# Altium schematic sheet Connect_board.SchDoc
size A3
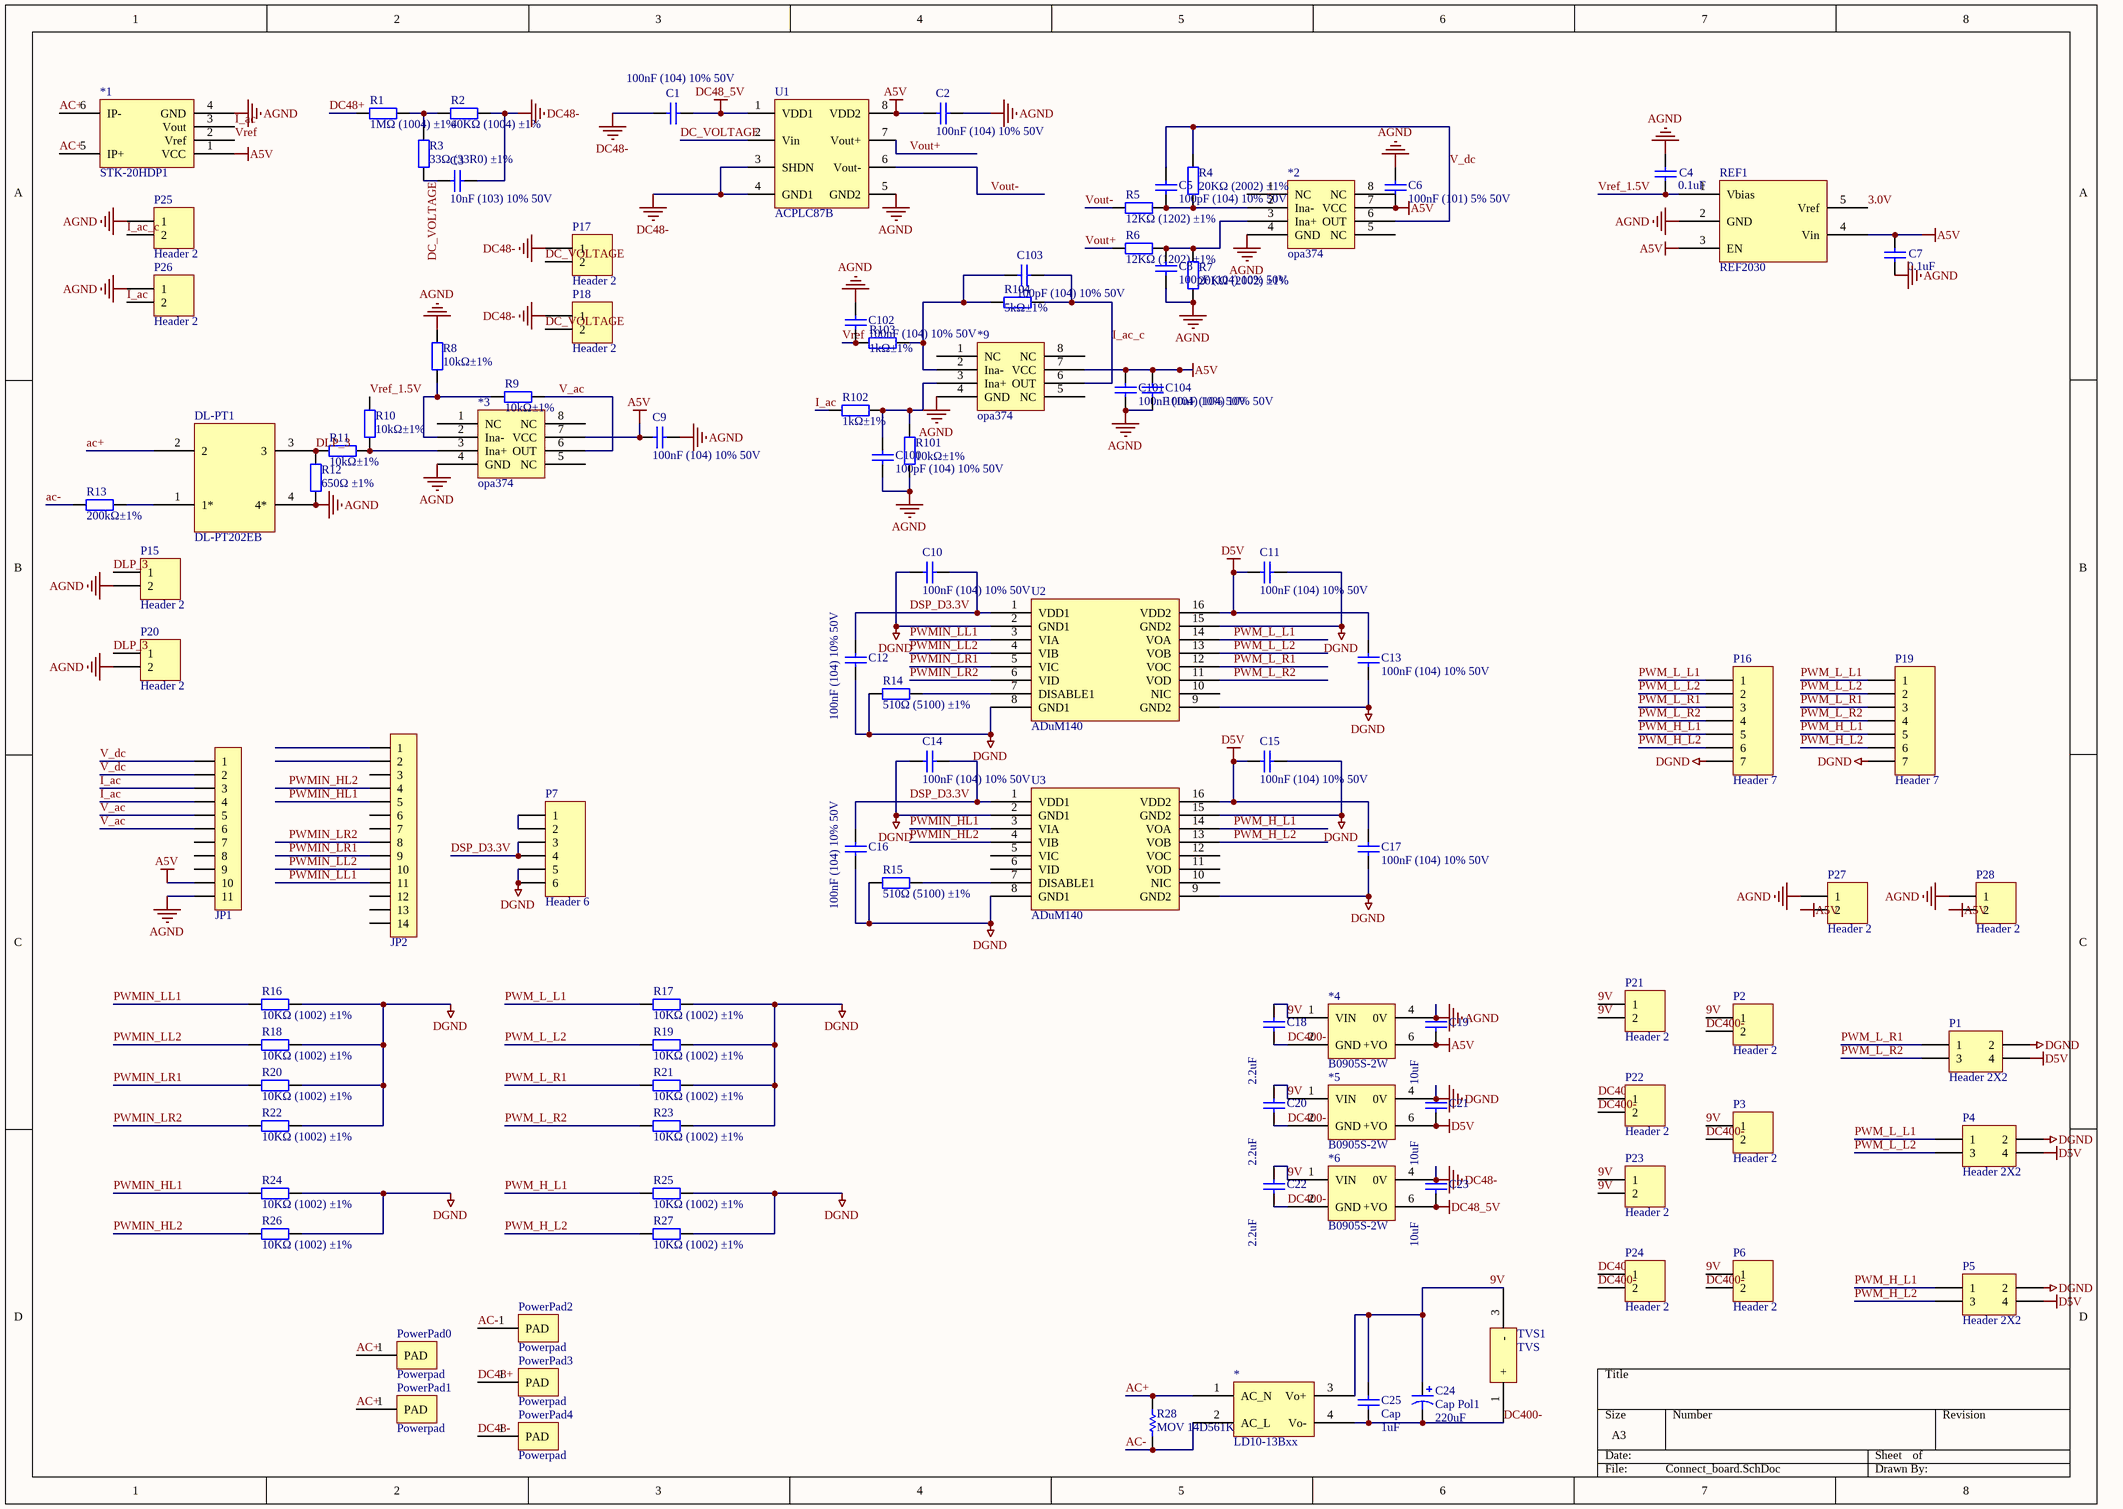
[diagram p0: Connect_board.SchDoc]

## Parts
*  LD10-13Bxx  [LD10-13]
*1  STK-20HDP1  [STK-20HDP1]
*2  opa374  [OPA2374]
*3  opa374  [OPA2374]
*4  B0905S-2W  [B0905S-2W]
*5  B0905S-2W  [B0905S-2W]
*6  B0905S-2W  [B0905S-2W]
*9  opa374  [OPA2374]
C1  100nF (104) 10% 50V  [0603_C]
C2  100nF (104) 10% 50V  [0603_C]
C3  10nF (103) 10% 50V  [1206R]
C4  value 0.1uF  [0603_C]  (hidden comment: Cap)
C5  100pF (104) 10% 50V  [0603_C]
C6  100nF (101) 5% 50V  [0603_C]
C7  value 0.1uF  [0603_C]  (hidden comment: Cap)
C8  100pF (104) 10% 50V  [0603_C]
C9  100nF (104) 10% 50V  [0603_C]
C10  100nF (104) 10% 50V  [0603_C]
C11  100nF (104) 10% 50V  [0603_C]
C12  100nF (104) 10% 50V  [0603_C]
C13  100nF (104) 10% 50V  [0603_C]
C14  100nF (104) 10% 50V  [0603_C]
C15  100nF (104) 10% 50V  [0603_C]
C16  100nF (104) 10% 50V  [0603_C]
C17  100nF (104) 10% 50V  [0603_C]
C18  2.2uF  [0603_C]
C19  10uF  [0603_C]
C20  2.2uF  [0603_C]
C21  10uF  [0603_C]
C22  2.2uF  [0603_C]
C23  10uF  [0603_C]
C24  Cap Pol1  value 220uF  [RB7.6-15]
C25  Cap  value 1uF  [0603_c]
C100  100pF (104) 10% 50V  [0603_C]
C101  100nF (104) 10% 50V  [0603_C]
C102  100nF (104) 10% 50V  [0603_C]
C103  100pF (104) 10% 50V  [0603_C]
C104  100nF (104) 10% 50V  [0603_C]
DL-PT1  DL-PT202EB  [DL-PT202EB]
JP1  HDR-1X11  [HDR1X11]  (value not drawn)
JP2  HDR-1X14  [HDR1X14]  (value not drawn)
P1  Header 2X2  [HDR2X2]
P2  Header 2  [HDR1X2]
P3  Header 2  [HDR1X2]
P4  Header 2X2  [HDR2X2]
P5  Header 2X2  [HDR2X2]
P6  Header 2  [HDR1X2]
P7  Header 6  [HDR1X6]
P15  Header 2  [HDR1X2]
P16  Header 7  [HDR1X7]
P17  Header 2  [HDR1X2]
P18  Header 2  [HDR1X2]
P19  Header 7  [HDR1X7]
P20  Header 2  [HDR1X2]
P21  Header 2  [HDR1X2]
P22  Header 2  [HDR1X2]
P23  Header 2  [HDR1X2]
P24  Header 2  [HDR1X2]
P25  Header 2  [HDR1X2]
P26  Header 2  [HDR1X2]
P27  Header 2  [HDR1X2]
P28  Header 2  [HDR1X2]
PowerPad0  Powerpad  [POWERPAD]
PowerPad1  Powerpad  [POWERPAD]
PowerPad2  Powerpad  [POWERPAD]
PowerPad3  Powerpad  [POWERPAD]
PowerPad4  Powerpad  [POWERPAD]
R1  1MΩ (1004) ±1%  [1206R]
R2  40KΩ (1004) ±1%  [1206R]
R3  33Ω (33R0) ±1%  [1206R]
R4  20KΩ (2002) ±1%  [0603_R]
R5  12KΩ (1202) ±1%  [0603_R]
R6  12KΩ (1202) ±1%  [0603_R]
R7  20KΩ (2002) ±1%  [0603_R]
R8  10kΩ±1%  [0603_R]
R9  10kΩ±1%  [0603_R]
R10  10kΩ±1%  [0603_R]
R11  10kΩ±1%  [0603_R]
R12  650Ω ±1%  [0603_R]
R13  200kΩ±1%  [1206R]
R14  510Ω (5100) ±1%  [0603_R]
R15  510Ω (5100) ±1%  [0603_R]
R16  10KΩ (1002) ±1%  [0603_R]
R17  10KΩ (1002) ±1%  [0603_R]
R18  10KΩ (1002) ±1%  [0603_R]
R19  10KΩ (1002) ±1%  [0603_R]
R20  10KΩ (1002) ±1%  [0603_R]
R21  10KΩ (1002) ±1%  [0603_R]
R22  10KΩ (1002) ±1%  [0603_R]
R23  10KΩ (1002) ±1%  [0603_R]
R24  10KΩ (1002) ±1%  [0603_R]
R25  10KΩ (1002) ±1%  [0603_R]
R26  10KΩ (1002) ±1%  [0603_R]
R27  10KΩ (1002) ±1%  [0603_R]
R28  MOV 14D561K  [AXIAL-0.3]
R101  10kΩ±1%  [0603_R]
R102  1kΩ±1%  [0603_R]
R103  1kΩ±1%  [0603_R]
R104  5kΩ±1%  [0603_R]
REF1  REF2030  [SOT23-5]
TVS1  TVS  [SMB]
U1  ACPLC87B  [LC-SOP-8_268mil]
U2  ADuM140  [LC-SOIC-16_208mil]
U3  ADuM140  [LC-SOIC-16_208mil]

## Nets
A5V: *1.1(VCC) *2.7(VCC) *3.7(VCC) *4.6(+VO) *9.7(VCC) C2.2 C6.1 C7.1 C9.1 C19.2 C101.1 C104.1 JP1.10 P27.2 P28.2 REF1.3(EN) REF1.4(Vin) U1.8(VDD2)
AGND: *1.4(GND) *2.4(GND) *3.4(GND) *4.4(0V) *9.4(GND) C2.1 C4.1 C6.2 C7.2 C8.2 C9.2 C19.1 C100.2 C101.2 C102.1 C104.2 DL-PT1.4(4*) JP1.11 P15.2 P20.2 P25.1 P26.1 P27.1 P28.1 R7.1 R8.2 R12.1 R101.2 REF1.2(GND) U1.5(GND2)
D5V: *5.6(+VO) C11.1 C13.2 C15.1 C17.2 C21.2 P1.4 P4.4 P5.4 U2.16(VDD2) U3.16(VDD2)
DC48-: *6.4(0V) C1.2 C3.1 C23.1 P17.1 P18.1 PowerPad4.1(PAD) R2.2 U1.3(SHDN) U1.4(GND1)
DC48_5V: *6.6(+VO) C1.1 C23.2 U1.1(VDD1)
DGND: *5.4(0V) C10.1 C11.2 C12.2 C13.1 C14.1 C15.2 C16.2 C17.1 C21.1 P1.2 P4.2 P5.2 P7.5 P7.6 P16.7 P19.7 R14.1 R15.1 R16.2 R17.2 R18.2 R19.2 R20.2 R21.2 R22.2 R23.2 R24.2 R25.2 R26.2 R27.2 U2.2(GND1) U2.8(GND1) U2.9(GND2) U2.15(GND2) U3.2(GND1) U3.8(GND1) U3.9(GND2) U3.15(GND2)
3.0V: REF1.5(Vref)
9V: *.3(Vo+) *4.1(VIN) *5.1(VIN) *6.1(VIN) C18.1 C20.1 C22.1 C24.1 C25.1 P2.1 P3.1 P6.1 P21.1 P21.2 P23.1 P23.2 TVS1.3(-)
AC+: *.1(AC_N) *1.5(IP+) *1.6(IP-) DL-PT1.2 PowerPad0.1(PAD) PowerPad1.1(PAD) R28.2
AC-: *.2(AC_L) PowerPad2.1(PAD) R13.1 R28.1
DC48+: PowerPad3.1(PAD) R1.1
DC400-: *.4(Vo-) *4.2(GND) *5.2(GND) *6.2(GND) C18.2 C20.2 C22.2 C24.2 C25.2 P2.2 P3.2 P6.2 P22.1 P22.2 P24.1 P24.2 TVS1.1(+)
DC_VOLTAGE: C3.2 P17.2 P18.2 R3.1 U1.2(Vin)
DLP_3: DL-PT1.3 P15.1 P20.1 R11.1 R12.2
DSP_D3.3V: C10.2 C12.1 C14.2 C16.1 P7.3 P7.4 U2.1(VDD1) U3.1(VDD1)
I_ac: *1.3(Vout) JP1.3 JP1.4 P26.2 R102.2
I_ac_c: *9.6(OUT) C103.2 P25.2 R104.1
PWM_H_L1: P5.1 P16.5 P19.5 R25.1 U3.14(VOA)
PWM_H_L2: P5.3 P16.6 P19.6 R27.1 U3.13(VOB)
PWM_L_L1: P4.1 P16.1 P19.1 R17.1 U2.14(VOA)
PWM_L_L2: P4.3 P16.2 P19.2 R19.1 U2.13(VOB)
PWM_L_R1: P1.1 P16.3 P19.3 R21.1 U2.12(VOC)
PWM_L_R2: P1.3 P16.4 P19.4 R23.1 U2.11(VOD)
PWMIN_HL1: JP2.5 R24.1 U3.3(VIA)
PWMIN_HL2: JP2.4 R26.1 U3.4(VIB)
PWMIN_LL1: JP2.11 R16.1 U2.3(VIA)
PWMIN_LL2: JP2.10 R18.1 U2.4(VIB)
PWMIN_LR1: JP2.9 R20.1 U2.5(VIC)
PWMIN_LR2: JP2.8 R22.1 U2.6(VID)
V_ac: *3.6(OUT) JP1.5 JP1.6 R9.2
V_dc: *2.6(OUT) C5.1 JP1.1 JP1.2 R4.2
Vout+: R6.1 U1.7(Vout+)
Vout-: R5.1 U1.6(Vout-)
Vref: *1.2(Vref) C102.2 R103.2
Vref_1.5V: C4.2 R10.2 REF1.1(Vbias)
Net*2_2: *2.2(Ina-) C5.2 R4.1 R5.2
Net*2_3: *2.3(Ina+) C8.1 R6.2 R7.2
Net*3_2: *3.2(Ina-) R8.1 R9.1
Net*3_3: *3.3(Ina+) R10.1 R11.2
Net*9_2: *9.2(Ina-) C103.1 R103.1 R104.2
Net*9_3: *9.3(Ina+) C100.1 R101.1 R102.1
NetDL-PT1_1: DL-PT1.1(1*) R13.2
NetP7_1: P7.1 P7.2
NetR1_2: R1.2 R2.1 R3.2
NetR14_2: R14.2 U2.7(DISABLE1)
NetR15_2: R15.2 U3.7(DISABLE1)

Not connected (* = marked no-connect by the designer): *2 1(NC) 5(NC) 8(NC); *3 1(NC) 5(NC) 8(NC); *9 1(NC) 5(NC) 8(NC); JP1 7 8 9; JP2 1 2 3 6 7 12 13 14; U2 10(NIC); U3 5(VIC) 6(VID) 10(NIC) 11(VOD) 12(VOC)

## Library data of the parts
*2 *3 *9 = opa2374
C1 C2 C5 C8-C23 C100-C104 = 0603 100nF (104) 10% 50V: 贴片电容; ComponentLink1Description: 供应商链接; ComponentLink1URL: http://www.szlcsc.com/product/details_15331.html; Package: 0603; Supplier: LC; SuppliersPartNumber: C14663
C3 = 0603 10nF (103) 10% 50V: 贴片电容; ComponentLink1Description: 供应商链接; ComponentLink1URL: http://www.szlcsc.com/product/details_58143.html; Package: 0603; Supplier: LC; SuppliersPartNumber: C57112
C4 C7 C25 = Cap: Capacitor; Published: 8-Jun-2000; LatestRevisionDate: 17-Jul-2002; LatestRevisionNote: Re-released for DXP Platform.; PackageReference: RAD-0.3; Publisher: Altium Limited
  C4 C7: PackageDescription: Radial Cap, Thru-Hole; 2 Leads; 0.3 in Pin Spacing
C6 = 0603 100pF (101) 5% 50V: 贴片电容; ComponentLink1Description: 供应商链接; ComponentLink1URL: http://www.szlcsc.com/product/details_15530.html; Package: 0603; Supplier: LC; SuppliersPartNumber: C14858
C24 = Cap Pol1: Polarized Capacitor (Radial); Published: 8-Jun-2000; LatestRevisionDate: 17-Jul-2002; LatestRevisionNote: Re-released for DXP Platform.; PackageReference: RB7.6-15; Publisher: Altium Limited
JP1 = Header 11: 11P接插件; 版权归属: 源创客; BOM名称: 11P接插件; 学习资源: www.ooocke.com
JP2 = Header 14: 14P接插件; 版权归属: 源创客; BOM名称: 14P接插件; 学习资源: www.ooocke.com
P1 P4 P5 = Header 2X2: Header, 2-Pin, Dual row; LatestRevisionDate: 17-Jul-2002; LatestRevisionNote: Re-released for DXP Platform.; Publisher: Altium Limited
P2 P3 P6 P15 P17 P18 P20-P28 = Header 2: Header, 2-Pin; LatestRevisionDate: 17-Jul-2002; LatestRevisionNote: Re-released for DXP Platform.; Publisher: Altium Limited
P7 = Header 6: Header, 6-Pin; LatestRevisionDate: 17-Jul-2002; LatestRevisionNote: Re-released for DXP Platform.; Publisher: Altium Limited
P16 P19 = Header 7: Header, 7-Pin; LatestRevisionDate: 17-Jul-2002; LatestRevisionNote: Re-released for DXP Platform.; Publisher: Altium Limited
R1 R2 R8-R13 R101-R104 = 0603 1MΩ (1004) 1%: 贴片电阻; ComponentLink1Description: 供应商链接; ComponentLink1URL: http://www.szlcsc.com/product/details_23662.html; Package: 0603; Supplier: LC; SuppliersPartNumber: C22935
R3 = 0603 33Ω (33R0) 1%: 贴片电阻; ComponentLink1Description: 供应商链接; ComponentLink1URL: http://www.szlcsc.com/product/details_23867.html; Package: 0603; Supplier: LC; SuppliersPartNumber: C23140
R4 R7 = 0603 20KΩ (2002) 1%: 贴片电阻; ComponentLink1Description: 供应商链接; ComponentLink1URL: http://www.szlcsc.com/product/details_4591.html; Package: 0603; Supplier: LC; SuppliersPartNumber: C4184
R5 R6 = 0603 12KΩ (1202) 1%: 贴片电阻; ComponentLink1Description: 供应商链接; ComponentLink1URL: http://www.szlcsc.com/product/details_23517.html; Package: 0603; Supplier: LC; SuppliersPartNumber: C22790
R14 R15 = 0603 510Ω (5100) 1%: 贴片电阻; ComponentLink1Description: 供应商链接; ComponentLink1URL: http://www.szlcsc.com/product/details_23920.html; Package: 0603; Supplier: LC; SuppliersPartNumber: C23193
R16-R27 = 0603 10KΩ (1002) 1%: 贴片电阻; ComponentLink1Description: 供应商链接; ComponentLink1URL: http://www.szlcsc.com/product/details_26547.html; Package: 0603; Supplier: LC; SuppliersPartNumber: C25804
R28 = Res1: Resistor; Published: 8-Jun-2000; LatestRevisionDate: 17-Jul-2002; LatestRevisionNote: Re-released for DXP Platform.; PackageReference: AXIAL-0.3; Publisher: Altium Limited